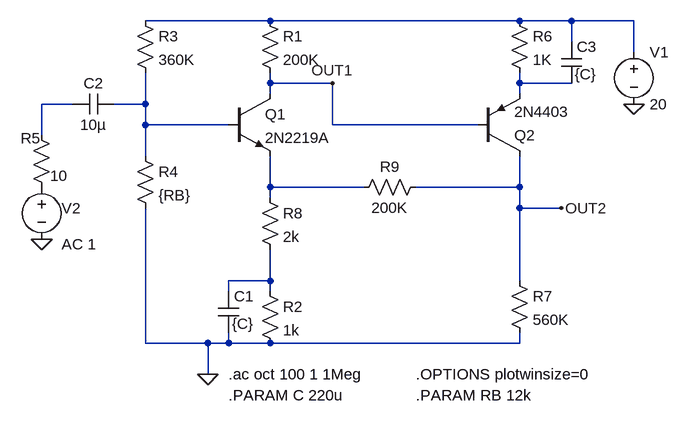
[diagram p0: schematic Fig_6-25_2_Tr_Amp_AC.asc]
Fig_6-25_2_Tr_Amp_AC.asc, the LTspice schematic file:
Version 4
SHEET 1 1028 704
WIRE 128 64 -64 64
WIRE 512 64 128 64
WIRE 592 64 512 64
WIRE 688 64 592 64
WIRE 592 96 592 64
WIRE 688 112 688 64
WIRE 128 160 128 144
WIRE 224 160 128 160
WIRE 512 160 512 144
WIRE 592 160 512 160
WIRE 128 176 128 160
WIRE 512 176 512 160
WIRE -176 192 -224 192
WIRE -64 192 -64 144
WIRE -64 192 -112 192
WIRE -64 224 -64 192
WIRE 64 224 -64 224
WIRE 224 224 224 160
WIRE 448 224 224 224
WIRE -224 240 -224 192
WIRE -64 272 -64 224
WIRE 128 320 128 272
WIRE 272 320 128 320
WIRE 512 320 512 272
WIRE 512 320 352 320
WIRE 128 336 128 320
WIRE 512 352 512 320
WIRE 576 352 512 352
WIRE 128 464 128 416
WIRE 128 464 64 464
WIRE 512 464 512 352
WIRE 64 480 64 464
WIRE 128 480 128 464
WIRE -64 560 -64 352
WIRE 32 560 -64 560
WIRE 64 560 64 544
WIRE 64 560 32 560
WIRE 128 560 64 560
WIRE 512 560 512 544
WIRE 512 560 128 560
WIRE 32 608 32 560
FLAG 32 608 0
FLAG -224 400 0
FLAG 688 192 0
FLAG 224 160 OUT1
FLAG 576 352 OUT2
SYMBOL npn 64 176 R0
SYMATTR InstName Q1
SYMATTR Value 2N2219A
SYMBOL res 112 48 R0
SYMATTR InstName R1
SYMATTR Value 200K
SYMBOL res 112 464 R0
SYMATTR InstName R2
SYMATTR Value 1k
SYMBOL res -80 48 R0
SYMATTR InstName R3
SYMATTR Value 360K
SYMBOL res -80 256 R0
SYMATTR InstName R4
SYMATTR Value {RB}
SYMBOL voltage 688 96 R0
WINDOW 123 0 0 Left 2
WINDOW 39 0 0 Left 2
SYMATTR InstName V1
SYMATTR Value 20
SYMBOL voltage -224 304 R0
WINDOW 123 31 104 Left 2
WINDOW 39 0 0 Left 2
WINDOW 0 31 48 Left 2
WINDOW 3 31 76 Left 2
SYMATTR Value2 AC 1
SYMATTR InstName V2
SYMATTR Value ""
SYMBOL res -240 224 R0
WINDOW 0 -16 21 Left 2
WINDOW 3 29 78 Left 2
SYMATTR InstName R5
SYMATTR Value 10
SYMBOL cap 48 480 R0
WINDOW 3 21 50 Left 2
SYMATTR Value {C}
SYMATTR InstName C1
SYMBOL cap -112 176 R90
WINDOW 0 0 32 VBottom 2
WINDOW 3 32 32 VTop 2
SYMATTR InstName C2
SYMATTR Value 10µ
SYMBOL res 496 48 R0
SYMATTR InstName R6
SYMATTR Value 1K
SYMBOL res 496 448 R0
SYMATTR InstName R7
SYMATTR Value 560K
SYMBOL pnp 448 272 M180
SYMATTR InstName Q2
SYMATTR Value 2N4403
SYMBOL cap 576 96 R0
WINDOW 3 21 50 Left 2
SYMATTR Value {C}
SYMATTR InstName C3
SYMBOL res 112 320 R0
SYMATTR InstName R8
SYMATTR Value 2k
SYMBOL res 368 304 R90
WINDOW 0 0 56 VBottom 2
WINDOW 3 32 56 VTop 2
SYMATTR InstName R9
SYMATTR Value 200K
TEXT 64 608 Left 2 !.ac oct 100 1 1Meg
TEXT 64 640 Left 2 !.PARAM C 220u
TEXT 352 640 Left 2 !.PARAM RB 12k
TEXT 352 608 Left 2 !.OPTIONS plotwinsize=0

The netlist it stands for:
* Fig_6-25_2_Tr_Amp_AC.asc
Q1 OUT1 N004 N005 0 2N2219A
R1 N001 OUT1 200K
R2 N006 0 1k
R3 N001 N004 360K
R4 N004 0 {RB}
V1 N001 0 20
V2 P001 0 AC 1
R5 N003 P001 10
C1 N006 0 {C}
C2 N004 N003 10µ
R6 N001 N002 1K
R7 OUT2 0 560K
Q2 OUT2 OUT1 N002 0 2N4403
C3 N001 N002 {C}
R8 N005 N006 2k
R9 OUT2 N005 200K
.model NPN NPN
.model PNP PNP
.lib standard.bjt
.ac oct 100 1 1Meg
.PARAM C 220u
.PARAM RB 12k
.OPTIONS plotwinsize=0
.backanno
.end